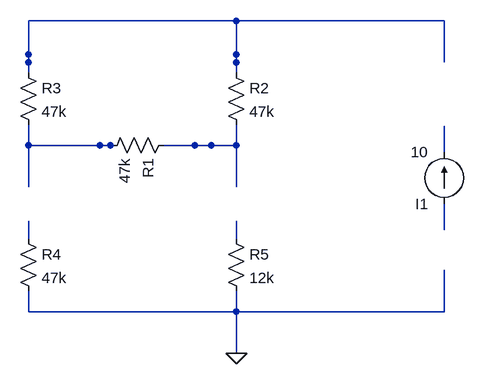
[diagram p0: schematic pannel2_solution.asc]
pannel2_solution.asc, the LTspice schematic file:
Version 4
SHEET 1 880 680
WIRE 464 384 537 384
WIRE 366 384 382 384
SYMBOL res 480 368 R90
SYMATTR InstName R1
SYMATTR Value 47k
WIRE 576 272 576 244
WIRE 576 384 576 352
SYMBOL res 560 256 R0
SYMATTR InstName R2
SYMATTR Value 47k
WIRE 256 272 256 244
WIRE 256 384 256 352
SYMBOL res 240 256 R0
SYMATTR InstName R3
SYMATTR Value 47k
WIRE 256 528 256 500
WIRE 256 640 256 608
SYMBOL res 240 512 R0
SYMATTR InstName R4
SYMATTR Value 47k
WIRE 576 528 576 500
WIRE 576 640 576 608
SYMBOL res 560 512 R0
SYMATTR InstName R5
SYMATTR Value 12k
WIRE 896 474 896 514
WIRE 896 354 896 394
SYMBOL current 896 474 R180
SYMATTR InstName I1
SYMATTR Value 10
FLAG 576 704 0
WIRE 512 384 576 384
WIRE 576 384 576 448
WIRE 256 384 256 448
WIRE 256 384 320 384
WIRE 256 640 320 640
WIRE 512 640 576 640
WIRE 576 640 640 640
WIRE 576 640 576 704
WIRE 576 192 576 256
WIRE 576 192 640 192
WIRE 512 192 576 192
WIRE 256 192 256 256
WIRE 256 192 320 192
WIRE 832 192 896 192
WIRE 896 192 896 256
WIRE 832 640 896 640
WIRE 896 576 896 640
WIRE 320 384 384 384
WIRE 448 640 512 640
WIRE 384 640 448 640
WIRE 320 640 384 640
WIRE 320 192 384 192
WIRE 384 192 448 192
WIRE 448 192 512 192
WIRE 640 192 704 192
WIRE 704 192 768 192
WIRE 768 192 832 192
WIRE 640 640 704 640
WIRE 704 640 768 640
WIRE 768 640 832 640

The netlist it stands for:
* pannel2_solution.asc
R1 N001 N002 47k
R2 N003 N001 47k
R3 N003 N002 47k
R4 N004 0 47k
R5 N005 0 12k
I1 N006 N007 10
.backanno
.end